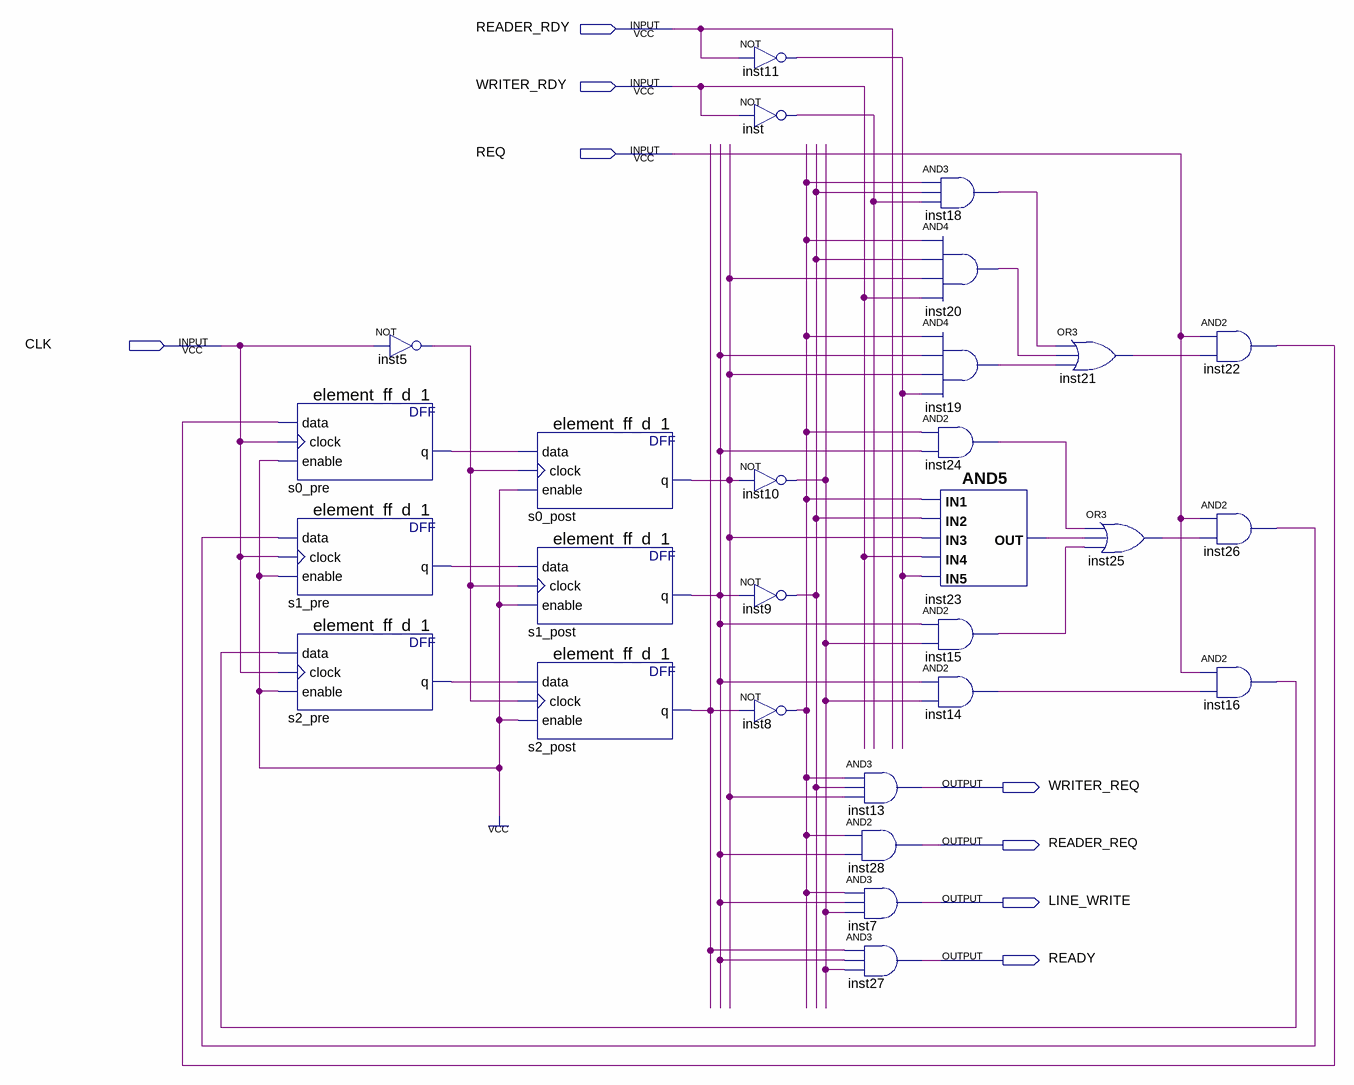
[diagram p0: schematic sheet]
// Quartus schematic block-data-cache-state-machine-wm.bdf as structural Verilog: 28 symbols, 8 pins
module \block-data-cache-state-machine-wm  (
  input  READER_RDY,
  input  WRITER_RDY,
  input  REQ,
  input  CLK,
  output WRITER_REQ,
  output READER_REQ,
  output LINE_WRITE,
  output READY
);

  wire inst5_out, inst8_out, inst9_out, inst10_out, inst11_out, inst14_out, inst15_out, inst16_out,
       inst18_out, inst19_out, inst20_out, inst21_out, inst22_out, inst23_out, inst24_out, inst25_out,
       inst26_out, inst_out, s0_post_q, s0_pre_q, s1_post_q, s1_pre_q, s2_post_q, s2_pre_q;

  element_ff_d_1 s0_pre (.data(inst22_out), .clock(CLK), .enable(1'b1), .q(s0_pre_q));
  element_ff_d_1 s1_pre (.data(inst26_out), .clock(CLK), .enable(1'b1), .q(s1_pre_q));
  element_ff_d_1 s2_pre (.data(inst16_out), .clock(CLK), .enable(1'b1), .q(s2_pre_q));
  not inst5 (inst5_out, CLK);
  element_ff_d_1 s0_post (.data(s0_pre_q), .clock(inst5_out), .enable(1'b1), .q(s0_post_q));
  element_ff_d_1 s1_post (.data(s1_pre_q), .clock(inst5_out), .enable(1'b1), .q(s1_post_q));
  element_ff_d_1 s2_post (.data(s2_pre_q), .clock(inst5_out), .enable(1'b1), .q(s2_post_q));
  not inst11 (inst11_out, READER_RDY);
  not inst (inst_out, WRITER_RDY);
  not inst10 (inst10_out, s0_post_q);
  not inst9 (inst9_out, s1_post_q);
  not inst8 (inst8_out, s2_post_q);
  and inst13 (WRITER_REQ, inst8_out, inst9_out, s0_post_q);
  and inst28 (READER_REQ, inst8_out, s1_post_q);
  and inst7 (LINE_WRITE, inst8_out, s1_post_q, inst10_out);
  and inst27 (READY, s2_post_q, s1_post_q, inst10_out);
  and inst18 (inst18_out, inst8_out, inst9_out, inst_out);
  and inst20 (inst20_out, inst8_out, inst9_out, s0_post_q, WRITER_RDY);
  and inst19 (inst19_out, inst8_out, s1_post_q, s0_post_q, inst11_out);
  and inst24 (inst24_out, inst8_out, s1_post_q);
  and inst23 (inst23_out, inst8_out, inst9_out, s0_post_q, WRITER_RDY, inst11_out);
  and inst15 (inst15_out, s1_post_q, inst10_out);
  and inst14 (inst14_out, s1_post_q, inst10_out);
  or inst21 (inst21_out, inst18_out, inst20_out, inst19_out);
  or inst25 (inst25_out, inst24_out, inst23_out, inst15_out);
  and inst22 (inst22_out, REQ, inst21_out);
  and inst26 (inst26_out, REQ, inst25_out);
  and inst16 (inst16_out, REQ, inst14_out);
endmodule
